# EAGLE schematic IMU (EAGLE 9.6.2)
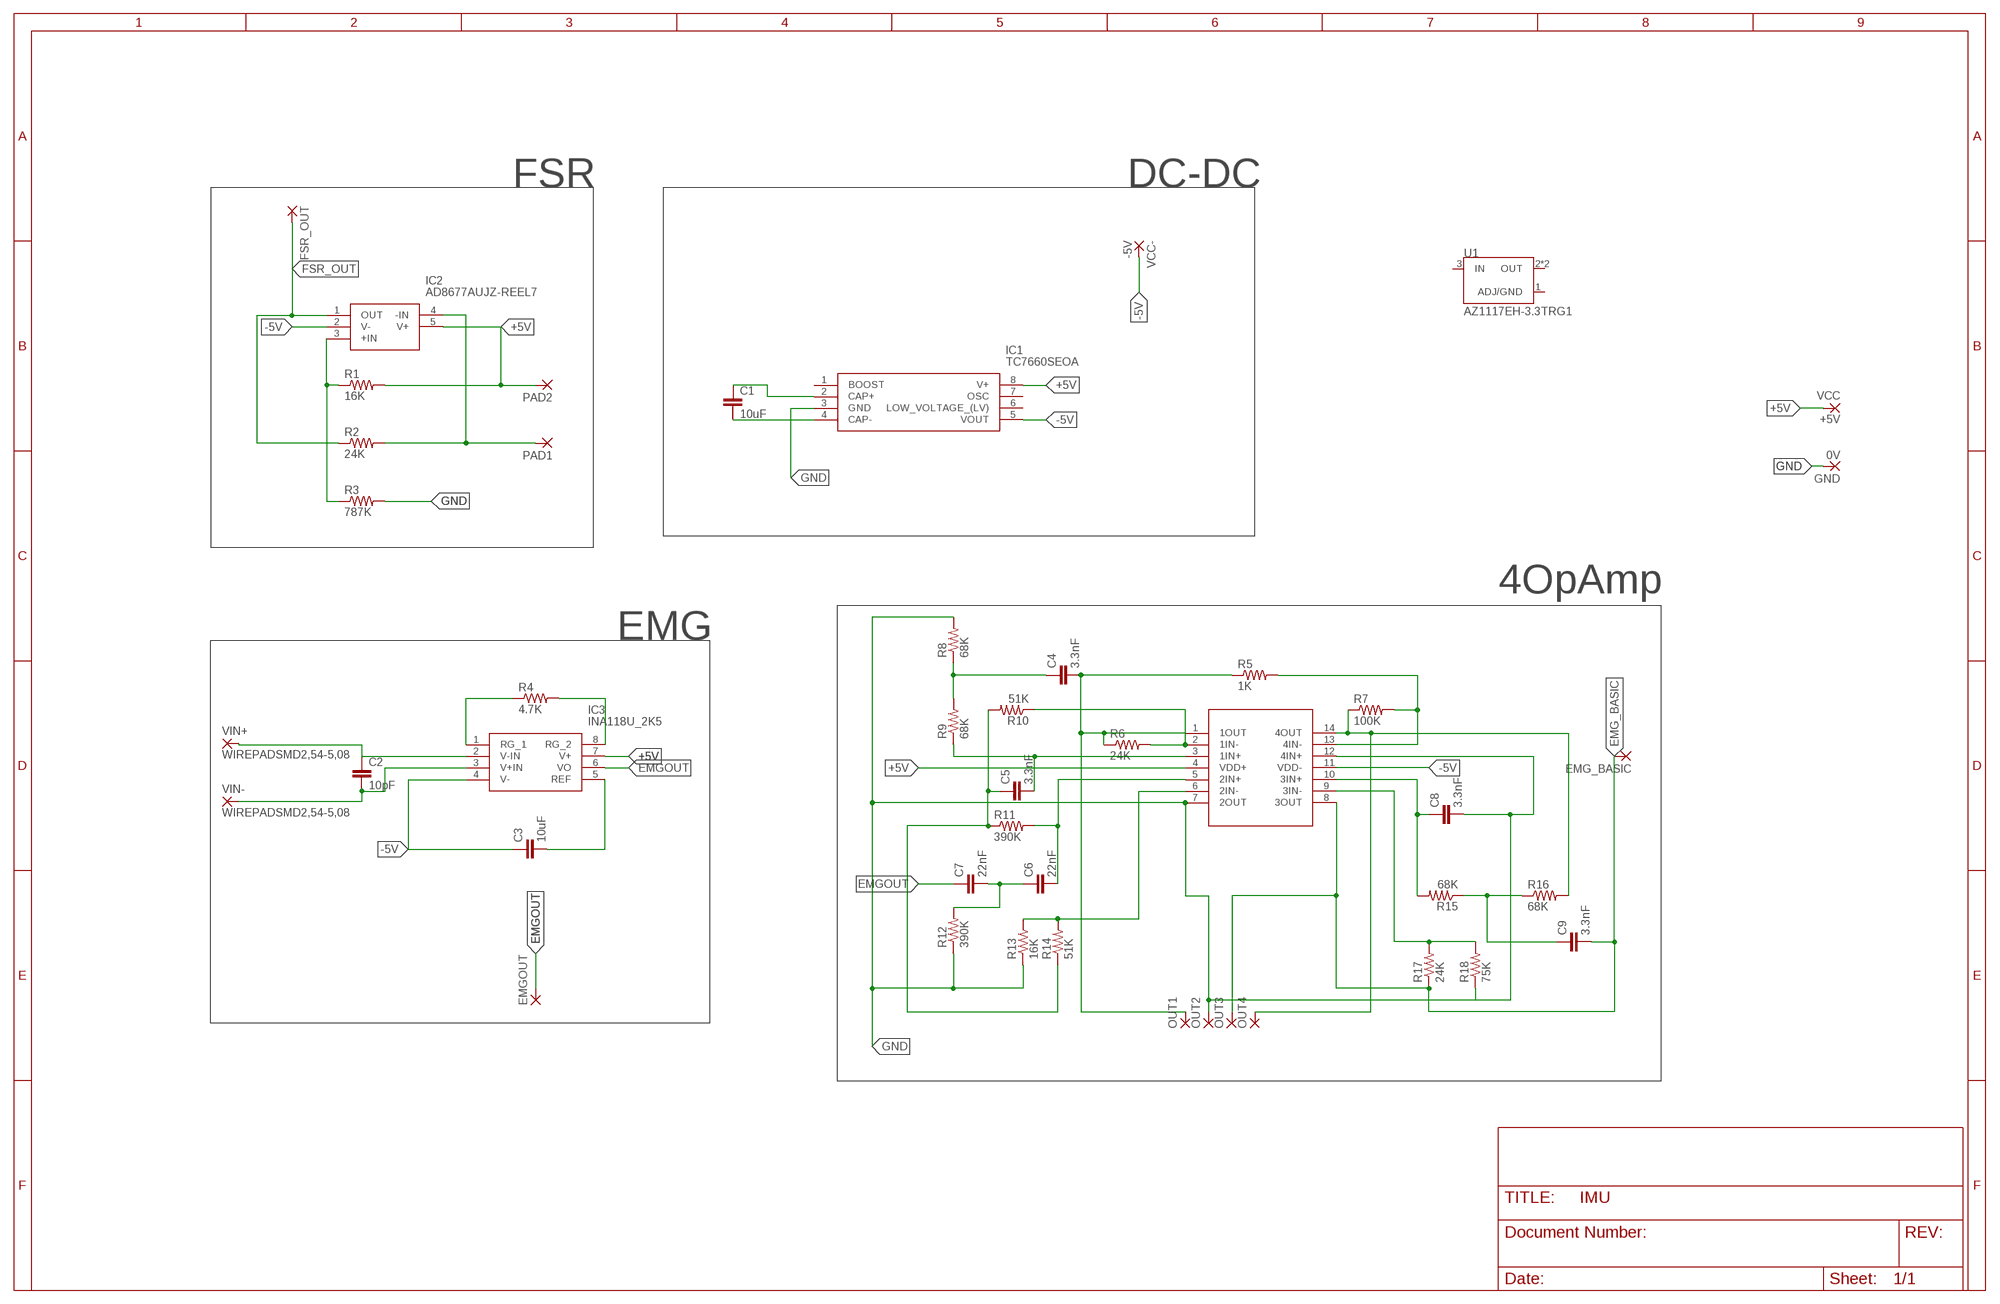
[diagram p0: schematic, sheet 1]

## Parts
C1  10uF  C-EUC0603K  [C0603K]
C2  10pF  C-EUC0402K  [C0402K]
C3  10uF  C-EUC0402K  [C0402K]
C4  3.3nF  C-EUC1206  [C1206]
C5  3.3nF  C-EUC1206  [C1206]
C6  22nF  C-EUC0805  [C0805]
C7  22nF  C-EUC0805  [C0805]
C8  3.3nF  C-EUC1206  [C1206]
C9  3.3nF  C-EUC1206  [C1206]
EMG_BASIC  1,6/0,8  [1,6/0,8]
EMGOUT  1,6/0,8  [1,6/0,8]
FSR_OUT  1,6/0,8  [1,6/0,8]
GND  0V  1,6/0,8  [1,6/0,8]
IC1  TC7660SEOA  [SOIC127P600X175-8N]
IC2  AD8677AUJZ-REEL7  [SOT95P280X100-5N]
IC3  INA118U_2K5  [SOIC127P600X175-8N]
OUT1  1,6/0,8  [1,6/0,8]
OUT2  1,6/0,8  [1,6/0,8]
OUT3  1,6/0,8  [1,6/0,8]
OUT4  1,6/0,8  [1,6/0,8]
PAD1  SMD2  [SMD1,27-2,54]
PAD2  SMD2  [SMD1,27-2,54]
R1  16K  R-US_R0402  [R0402]
R2  24K  R-US_R0402  [R0402]
R3  787K  R-US_R0805  [R0805]
R4  4.7K  R-US_R0402  [R0402]
R5  1K  R-US_R0201  [R0201]
R6  24K  R-US_R0201  [R0201]
R7  100K  R-US_R1005  [R1005]
R8  68K  R-US_R0201  [R0201]
R9  68K  R-US_R0201  [R0201]
R10  51K  R-US_R0201  [R0201]
R11  390K  R-US_R0603  [R0603]
R12  390K  R-US_R0603  [R0603]
R13  16K  R-US_R0201  [R0201]
R14  51K  R-US_R0201  [R0201]
R15  68K  R-US_R0201  [R0201]
R16  68K  R-US_R0201  [R0201]
R17  24K  R-US_R0201  [R0201]
R18  75K  R-US_R0201  [R0201]
U1  AZ1117EH-3.3TRG1  [SOT230P700X180-4N]
U$1  TLC2274-HT  [SOP65P640X120-14N]
VCC  +5V  1,6/0,8  [1,6/0,8]
VCC-  -5V  1,6/0,8  [1,6/0,8]
VIN+  WIREPADSMD2,54-5,08  [SMD2,54-5,08]
VIN-  WIREPADSMD2,54-5,08  [SMD2,54-5,08]

## Nets
+5V: IC1.8(V+) IC2.5(V+) IC3.7(V+) PAD2.1(P) R1.2 U$1.4(VDD+) VCC.1(P)
-5V: C3.1 IC1.5(VOUT) IC2.2(V-) IC3.4(V-) U$1.11(VDD-) VCC-.1(P)
EMG_BASIC: C9.2 EMG_BASIC.1(P) OUT3.1(P) R17.1 U$1.8(3OUT)
EMGOUT: C7.1 EMGOUT.1(P) IC3.6(VO)
FSR_OUT: FSR_OUT.1(P) IC2.1(OUT) R2.1
GND: C8.2 GND.1(P) IC1.3(GND) OUT2.1(P) R3.2 R8.2 R12.1 R13.1 R18.1 U$1.7(2OUT) U$1.12(4IN+)
N$1: C1.1 IC1.2(CAP+)
N$2: C1.2 IC1.4(CAP-)
N$3: C2.1 IC3.2(V-IN) VIN+.1(P)
N$7: IC2.4(-IN) PAD1.1(P) R2.2
N$8: C2.2 IC3.3(V+IN) VIN-.1(P)
N$10: IC2.3(+IN) R1.1 R3.1
N$11: C3.2 IC3.5(REF)
N$12: IC3.1(RG_1) R4.1
N$13: IC3.8(RG_2) R4.2
N$14: C4.2 OUT1.1(P) R5.1 R6.1 U$1.1(1OUT)
N$17: OUT4.1(P) R7.1 R16.2 U$1.14(4OUT)
N$18: R5.2 R7.2 U$1.13(4IN-)
N$19: R6.2 R10.1 U$1.2(1IN-)
N$20: C5.2 R9.1 U$1.3(1IN+)
N$21: C4.1 R8.1 R9.2
N$22: C5.1 R10.2 R11.1 R14.1
N$23: C6.1 C7.2 R12.2
N$24: C6.2 R11.2 U$1.5(2IN+)
N$26: R13.2 R14.2 U$1.6(2IN-)
N$27: C9.1 R15.1 R16.1
N$28: C8.1 R15.2 U$1.10(3IN+)
N$30: R17.2 R18.2 U$1.9(3IN-)
Unconnected: IC1.1(BOOST) IC1.6(LOW_VOLTAGE_(LV)) IC1.7(OSC) U1.2(OUT) U1.3(IN) U1.4(OUT)

## Notes on the sheet
- FSR | DC-DC
- 4OpAmp
- EMG

## Power pins joined to a net without a drawn wire
ADJ/GND: U1.1(ADJ/GND)

## Library data of the parts
C1-C9 = rcl:C-EU: CAPACITOR, European symbol; SPICEPREFIX: C
EMG_BASIC EMGOUT FSR_OUT GND OUT1-OUT4 VCC VCC- = wirepad:1,6/0,8: THROUGH-HOLE PAD
IC1 = TC7660SEOA:TC7660SEOA: DC-TO-DC VOLTAGE CONVERTER Source: Datasheet <http://componentsearchengine.com/Datasheets/1/TC7660SEOA.pdf>; ARROW_PART_NUMBER: TC7660SEOA; ARROW_PRICE-STOCK: https://www.arrow.com/en/products/tc7660seoa/microchip-technology; DESCRIPTION: DC-TO-DC VOLTAGE CONVERTER; HEIGHT: 1.75mm; MANUFACTURER_NAME: Microchip; MANUFACTURER_PART_NUMBER: TC7660SEOA; MOUSER_PART_NUMBER: 579-TC7660SEOA; MOUSER_PRICE-STOCK: https://www.mouser.co.uk/ProductDetail/Microchip-Technology/TC7660SEOA?qs=cQYLKLPzRJl3hJI5k2EAHg%3D%3D
IC2 = AD8677AUJZ-REEL7:AD8677AUJZ-REEL7: Precision Amplifiers 130uV Max Offset VTG Source: Datasheet <http://www.analog.com/media/en/technical-documentation/data-sheets/AD8677.pdf>; ARROW_PART_NUMBER: AD8677AUJZ-REEL7; ARROW_PRICE-STOCK: https://www.arrow.com/en/products/ad8677aujz-reel7/analog-devices; DESCRIPTION: Precision Amplifiers 130uV Max Offset VTG; HEIGHT: 1mm; MANUFACTURER_NAME: Analog Devices; MANUFACTURER_PART_NUMBER: AD8677AUJZ-REEL7; MOUSER_PART_NUMBER: 584-AD8677AUJZ-R7; MOUSER_PRICE-STOCK: https://www.mouser.co.uk/ProductDetail/Analog-Devices/AD8677AUJZ-REEL7?qs=%2FtpEQrCGXCxIKHu%2FfOAijA%3D%3D
IC3 = INA118U_2K5:INA118U_2K5: Precision, Low Power Instrumentation Amplifier Source: Datasheet <http://www.ti.com/lit/gpn/INA118>; ARROW_PART_NUMBER: INA118U/2K5; ARROW_PRICE-STOCK: https://www.arrow.com/en/products/ina118u2k5/texas-instruments; DESCRIPTION: Precision, Low Power Instrumentation Amplifier; HEIGHT: 1.75mm; MANUFACTURER_NAME: Texas Instruments; MANUFACTURER_PART_NUMBER: INA118U/2K5; MOUSER_PART_NUMBER: 595-INA118U/2K5; MOUSER_PRICE-STOCK: https://www.mouser.co.uk/ProductDetail/Texas-Instruments/INA118U-2K5?qs=VBduBm9rCJRVtE6eJbSA%2Fg%3D%3D
PAD1 PAD2 = wirepad:SMD2: SMD PAD
R1 R2 R11 = adafruit:R-US_: RESISTOR, American symbol
R3 R5 R6 R8-R10 R13-R18 = rcl:R-US_: RESISTOR, American symbol; SPICEPREFIX: R
R4 R7 R12 = adafruit@1:R-US_: RESISTOR, American symbol
U1 = AZ1117EH-3.3TRG1:AZ1117EH-3.3TRG1: Ldo.Vreg Pos 3, 3v 1a Sot223; DESCRIPTION: Linear Voltage Regulator IC 1 Output 1A SOT-223; DIGI-KEY_PART_NUMBER: AZ1117EH-3.3TRG1DICT-ND; MF: Diodes Inc.; MP: AZ1117EH-3.3TRG1; PACKAGE: SOT-223 Diodes Inc.; PURCHASE-URL: https://pricing.snapeda.com/search/part/AZ1117EH-3.3TRG1/?ref=eda
U$1 = TLC2274-HT:TLC2274-HT
VIN+ VIN- = wirepad:WIREPAD: Wire PAD connect wire on PCB